# Altium project LimeSDR-XTRX_1v3.PrjPcb (part 8 of 8)
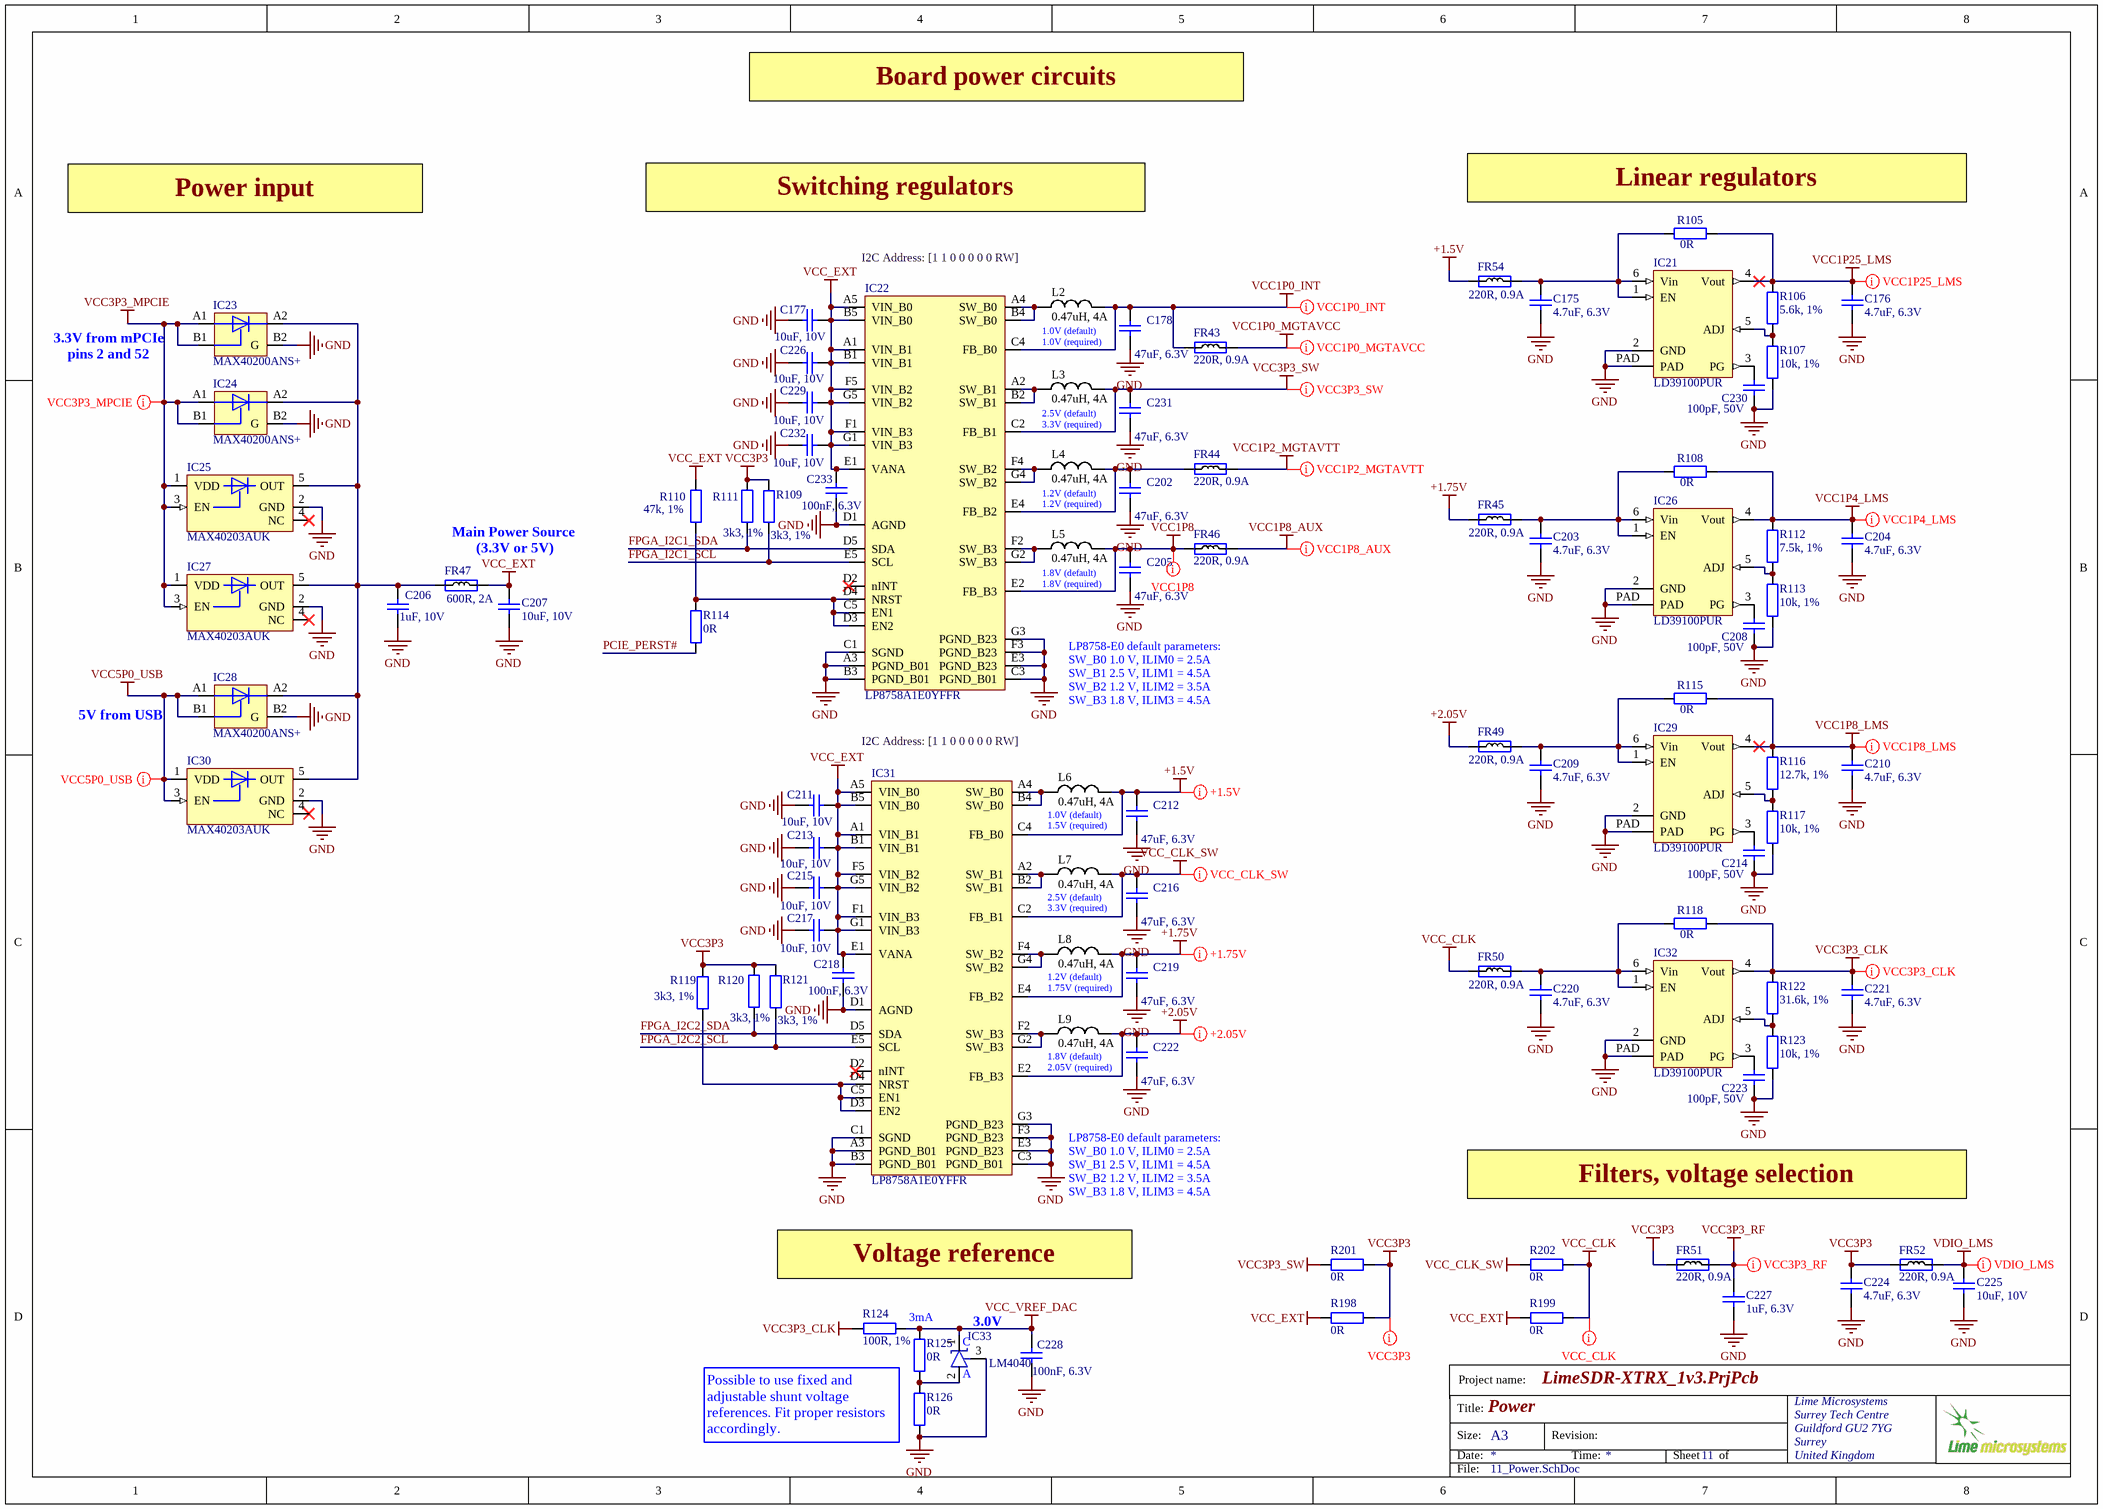
[diagram p11: 11_Power.SchDoc]

## Nets that join several sheets
GND: 05_LMS7002M_Misc (27 pins), 06_LMS7002M_RF (75 pins), 07_LMS7002M_Power (85 pins), 08_FPGA (116 pins), 09_Misc (64 pins), 10_Clock (40 pins), 11_Power (72 pins)
VCC1P0_INT: 08_FPGA (17 pins), 11_Power (C178.2 FR43.1 IC22.C4 L2.2)
VCC1P0_MGTAVCC: 08_FPGA (8 pins), 11_Power (FR43.2)
VCC1P2_MGTAVTT: 08_FPGA (8 pins), 11_Power (FR44.2)
VCC1P4_LMS: 07_LMS7002M_Power (FR22.2 FR23.2 FR24.2 FR25.2), 11_Power (C204.2 IC26.4 R108.2 R112.1)
VCC1P8_AUX: 08_FPGA (8 pins), 11_Power (FR46.2)
VCC1P8_LMS: 06_LMS7002M_RF (24 pins), 07_LMS7002M_Power (11 pins), 10_Clock (FR53.1), 11_Power (C210.2 IC29.4 R115.2 R116.1)
VCC1P25_LMS: 07_LMS7002M_Power (18 pins), 11_Power (C176.2 IC21.4 R105.2 R106.1)
VCC3P3: 08_FPGA (64 pins), 09_Misc (18 pins), 11_Power (10 pins)
VCC3P3_CLK: 09_Misc (FR38.1), 10_Clock (8 pins), 11_Power (5 pins)
VCC3P3_MPCIE: 09_Misc (X10.2 X10.52), 11_Power (8 pins)
VCC3P3_RF: 06_LMS7002M_RF (FR1.1 FR2.1 FR3.2 FR4.2), 11_Power (C227.1 FR51.2)
VCC5P0_USB: 09_Misc (C186.2 FR40.2 R84.2), 11_Power (IC28.A1 IC28.B1 IC30.1 IC30.3)
VCC_EXT: 08_FPGA (R46.2), 09_Misc (C187.1 FR41.1 IC19.C1), 11_Power (33 pins)
VCC_VREF_DAC: 10_Clock (R71.2), 11_Power (C228.1 IC33.1 R124.1 R125.1)
VDIO_LMS: 05_LMS7002M_Misc (9 pins), 07_LMS7002M_Power (R31.1), 11_Power (C225.2 FR52.2)
1PPSI_GPIO1(1N): 08_FPGA (IC7.M3), 09_Misc (R72.1 R76.1)
1PPSO_GPIO2(1P): 08_FPGA (IC7.L3), 09_Misc (R78.1)
EN_GPIO: 08_FPGA (IC7.D17), 09_Misc (IC20.1 IC20.5)
EN_TCXO: 08_FPGA (IC7.R19), 10_Clock (XO1.6)
EXT_CLK: 08_FPGA (IC7.V17), 10_Clock (IC15.6)
FPGA_CFG_CCLK: 08_FPGA (IC7.C11), 09_Misc (IC18.6)
FPGA_CFG_CS: 08_FPGA (IC7.K19), 09_Misc (IC18.1 R87.2)
FPGA_CFG_D00: 08_FPGA (IC7.D18), 09_Misc (R75.2)
FPGA_CFG_D01: 08_FPGA (IC7.D19), 09_Misc (R77.2)
FPGA_CFG_D02: 08_FPGA (IC7.G18), 09_Misc (R82.2)
FPGA_CFG_D03: 08_FPGA (IC7.F18), 09_Misc (R85.2)
FPGA_CLK: 08_FPGA (IC7.N17), 10_Clock (IC8.13)
FPGA_I2C1_SCL: 08_FPGA (IC7.M1), 09_Misc (IC9.1 IC9.4 IC13.6), 10_Clock (IC17.5), 11_Power (IC22.E5 R109.2)
FPGA_I2C1_SDA: 08_FPGA (IC7.N1), 09_Misc (IC9.6 IC13.5), 10_Clock (IC17.6), 11_Power (IC22.D5 R111.2)
FPGA_I2C2_SCL: 08_FPGA (IC7.U14), 11_Power (IC31.E5 R121.2)
FPGA_I2C2_SDA: 08_FPGA (IC7.U15), 11_Power (IC31.D5 R120.2)
FPGA_LED1: 08_FPGA (IC7.N18), 09_Misc (R99.2)
FPGA_LED2: 08_FPGA (IC7.V19), 09_Misc (R104.2)
FPGA_SPI_LMS_SS: 05_LMS7002M_Misc (R13.2), 08_FPGA (IC7.W13)
FPGA_SPI_MISO: 05_LMS7002M_Misc (R12.2), 08_FPGA (IC7.W15)
FPGA_SPI_MOSI: 05_LMS7002M_Misc (R11.2), 08_FPGA (IC7.W16)
FPGA_SPI_SCLK: 05_LMS7002M_Misc (R10.2), 08_FPGA (IC7.W14)
GNSS_1PPS: 08_FPGA (IC7.P3), 09_Misc (IC11.6)
GNSS_FIX: 08_FPGA (IC7.R18), 09_Misc (IC11.13)
GNSS_HW_R: 08_FPGA (IC7.U18), 09_Misc (C167.1 IC11.7)
GNSS_HW_S: 08_FPGA (IC7.L18), 09_Misc (C169.1 IC11.8)
GNSS_RXD: 08_FPGA (IC7.L1), 09_Misc (C164.1 FR37.1)
GNSS_TXD: 08_FPGA (IC7.N2), 09_Misc (C163.1 FR36.1)
GPIO8: 08_FPGA (IC7.N3), 09_Misc (IC20.6)
GPIO9_N: 08_FPGA (IC7.J1), 09_Misc (X12.4)
GPIO9_P: 08_FPGA (IC7.H1), 09_Misc (X12.2)
GPIO11_N: 08_FPGA (IC7.L2), 09_Misc (X12.8)
GPIO11_P: 08_FPGA (IC7.K2), 09_Misc (X12.6)
GPIO13: 05_LMS7002M_Misc (X8.8 X13.8), 08_FPGA (IC7.T17)
LED_WLAN#_GPIO6: 08_FPGA (IC7.M2), 09_Misc (X10.44)
LED_WPAN#_GPIO7: 08_FPGA (IC7.G2), 09_Misc (X10.46)
LED_WWAN#_GPIO5: 08_FPGA (IC7.G3), 09_Misc (X10.42)
LMK_CLKOUT4: 09_Misc (IC20.10), 10_Clock (IC8.17)
LMS_CORE_LDO_EN: 05_LMS7002M_Misc (IC1.U33 R9.1), 08_FPGA (IC7.W17)
LMS_DIQ1_D0: 05_LMS7002M_Misc (IC1.AG31), 08_FPGA (IC7.J17)
LMS_DIQ1_D1: 05_LMS7002M_Misc (IC1.AF30), 08_FPGA (IC7.H17)
LMS_DIQ1_D2: 05_LMS7002M_Misc (IC1.AF34), 08_FPGA (IC7.H19)
LMS_DIQ1_D3: 05_LMS7002M_Misc (IC1.AE31), 08_FPGA (IC7.K17)
LMS_DIQ1_D4: 05_LMS7002M_Misc (IC1.AD30), 08_FPGA (IC7.G17)
LMS_DIQ1_D5: 05_LMS7002M_Misc (IC1.AC29), 08_FPGA (IC7.V16)
LMS_DIQ1_D6: 05_LMS7002M_Misc (IC1.AE33), 08_FPGA (IC7.J19)
LMS_DIQ1_D7: 05_LMS7002M_Misc (IC1.AD32), 08_FPGA (IC7.M19)
LMS_DIQ1_D8: 05_LMS7002M_Misc (IC1.AC31), 08_FPGA (IC7.P17)
LMS_DIQ1_D9: 05_LMS7002M_Misc (IC1.AC33), 08_FPGA (IC7.N19)
LMS_DIQ1_D10: 05_LMS7002M_Misc (IC1.AB30), 08_FPGA (IC7.U17)
LMS_DIQ1_D11: 05_LMS7002M_Misc (IC1.AB32), 08_FPGA (IC7.U16)
LMS_DIQ2_D0: 05_LMS7002M_Misc (IC1.H30), 08_FPGA (IC7.W2)
LMS_DIQ2_D1: 05_LMS7002M_Misc (IC1.J31), 08_FPGA (IC7.U2)
LMS_DIQ2_D2: 05_LMS7002M_Misc (IC1.K30), 08_FPGA (IC7.U3)
LMS_DIQ2_D3: 05_LMS7002M_Misc (IC1.K32), 08_FPGA (IC7.V3)
LMS_DIQ2_D4: 05_LMS7002M_Misc (IC1.L31), 08_FPGA (IC7.V4)
LMS_DIQ2_D5: 05_LMS7002M_Misc (IC1.K34), 08_FPGA (IC7.V2)
LMS_DIQ2_D6: 05_LMS7002M_Misc (IC1.M30), 08_FPGA (IC7.V5)
LMS_DIQ2_D7: 05_LMS7002M_Misc (IC1.M32), 08_FPGA (IC7.W4)
LMS_DIQ2_D8: 05_LMS7002M_Misc (IC1.N31), 08_FPGA (IC7.V8)
LMS_DIQ2_D9: 05_LMS7002M_Misc (IC1.N33), 08_FPGA (IC7.U4)
LMS_DIQ2_D10: 05_LMS7002M_Misc (IC1.P30), 08_FPGA (IC7.U8)
LMS_DIQ2_D11: 05_LMS7002M_Misc (IC1.P32), 08_FPGA (IC7.U7)
LMS_EN_IQSEL1: 05_LMS7002M_Misc (IC1.Y32), 08_FPGA (IC7.P19)
LMS_EN_IQSEL2: 05_LMS7002M_Misc (IC1.R33), 08_FPGA (IC7.W7)
LMS_FCLK1: 05_LMS7002M_Misc (R2.1), 08_FPGA (IC7.G19)
LMS_FCLK2: 05_LMS7002M_Misc (R14.1), 08_FPGA (IC7.W6)
LMS_MCLK1: 05_LMS7002M_Misc (IC1.AB34), 08_FPGA (IC7.L17)
LMS_MCLK2: 05_LMS7002M_Misc (IC1.P34), 08_FPGA (IC7.W5)
LMS_RESET: 05_LMS7002M_Misc (IC1.E27 R6.1), 08_FPGA (IC7.U19)
LMS_RXEN: 05_LMS7002M_Misc (IC1.V34 R8.1), 08_FPGA (IC7.W18)
LMS_RxPLL_CLK: 05_LMS7002M_Misc (IC1.AM24), 10_Clock (C157.2 R153.2)
LMS_TSTAO: 05_LMS7002M_Misc (IC1.B22), 08_FPGA (R47.2)
LMS_TXEN: 05_LMS7002M_Misc (IC1.U29 R7.1), 08_FPGA (IC7.W19)
LMS_TXNRX1: 05_LMS7002M_Misc (IC1.V32 R5.2), 08_FPGA (IC7.V15)
LMS_TXNRX2: 05_LMS7002M_Misc (IC1.U31 R15.2), 08_FPGA (IC7.U5)
LMS_TxPLL_CLK: 05_LMS7002M_Misc (IC1.E5), 10_Clock (C173.2 R151.2)
PCIE_CLK_IN: 09_Misc (X10.19), 10_Clock (R154.1)
PCIE_PERST#: 09_Misc (R89.1 X10.22), 11_Power (R114.1)
PCIE_REF_CLK_N: 08_FPGA (C96.1), 09_Misc (X10.11)
PCIE_REF_CLK_P: 08_FPGA (C95.1), 09_Misc (X10.13)
PCIE_RESERVED: 08_FPGA (IC7.V7), 09_Misc (R100.1)
PCIE_RX0_N: 08_FPGA (C103.1), 09_Misc (X10.31)
PCIE_RX0_P: 08_FPGA (C101.1), 09_Misc (X10.33)
PCIE_RX1_N: 08_FPGA (C99.1), 09_Misc (R101.1)
PCIE_RX1_P: 08_FPGA (C97.1), 09_Misc (R102.1)
PCIE_TX0_N: 08_FPGA (C104.2), 09_Misc (X10.23)
PCIE_TX0_P: 08_FPGA (C102.2), 09_Misc (X10.25)
PCIE_TX1_N: 08_FPGA (C100.2), 09_Misc (R96.1)
PCIE_TX1_P: 08_FPGA (C98.2), 09_Misc (R97.1)
PCIE_W_DISABLE2#: 08_FPGA (IC7.W3), 09_Misc (R103.1)
PERST#: 08_FPGA (IC7.T3), 09_Misc (R89.2)
RX_SW2: 06_LMS7002M_RF (R22.2), 08_FPGA (IC7.J3)
RX_SW3: 06_LMS7002M_RF (R23.2), 08_FPGA (IC7.K3)
SIM_CLK: 08_FPGA (IC7.T1), 09_Misc (IC16.C1)
SIM_DIO: 08_FPGA (IC7.T2), 09_Misc (IC16.A1)
SIM_ENA: 08_FPGA (IC7.U1), 09_Misc (IC16.C2)
SIM_MOD: 08_FPGA (IC7.R3), 09_Misc (IC16.B2)
SIM_RST: 08_FPGA (IC7.R2), 09_Misc (IC16.B1)
TDD_GPIO3_N: 08_FPGA (IC7.J2), 09_Misc (X10.17)
TDD_GPIO3_P: 08_FPGA (IC7.H2), 09_Misc (X10.20)
TX_SW: 06_LMS7002M_RF (R21.2), 08_FPGA (IC7.P1)
USB_26M: 08_FPGA (IC7.E19), 09_Misc (IC19.A2)
USB_CLK: 08_FPGA (IC7.C16), 09_Misc (R94.1)
USB_D0: 08_FPGA (IC7.B17), 09_Misc (IC19.B4)
USB_D1: 08_FPGA (IC7.A17), 09_Misc (IC19.C5)
USB_D2: 08_FPGA (IC7.B16), 09_Misc (IC19.C4)
USB_D3: 08_FPGA (IC7.A16), 09_Misc (IC19.D5)
USB_D4: 08_FPGA (IC7.B15), 09_Misc (IC19.D4)
USB_D5: 08_FPGA (IC7.A15), 09_Misc (IC19.E5)
USB_D6: 08_FPGA (IC7.A14), 09_Misc (IC19.E4)
USB_D7: 08_FPGA (IC7.C15), 09_Misc (IC19.E3)
USB_DIR: 08_FPGA (IC7.B18), 09_Misc (IC19.A4)
USB_NRST: 08_FPGA (IC7.M18), 09_Misc (IC19.C2)
USB_NXT: 08_FPGA (IC7.A18), 09_Misc (IC19.B5)
USB_STP: 08_FPGA (IC7.C17), 09_Misc (IC19.A3)

## Assembly variants
Default: not fitted C157 C174 C185 C208 C214 C223 C228 C230 ESD1 ESD2 ESD3 ESD4 ESD5 IC2 IC13 IC25 IC27 IC30 IC32 MN7 MN8 MN9 MN10 MN23 MN25 MN31 MN32 MN33 MN34 MN39 MN40 MN41 MN42 MN53 MN54 R67 R69 R70 R73 R105 R108 R114 R115 R122 R123 R125 R148 R152 R156 R198 R199 X9